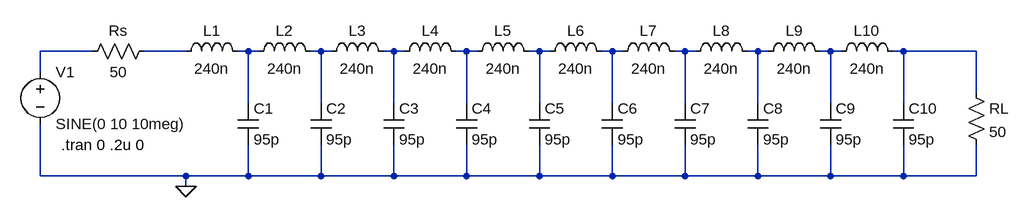
[diagram p0: schematic lab2_Schematic.asc]
lab2_Schematic.asc, the LTspice schematic file:
Version 4
SHEET 1 1592 680
WIRE 176 32 96 32
WIRE 320 32 256 32
WIRE 416 32 400 32
WIRE 432 32 416 32
WIRE 528 32 512 32
WIRE 544 32 528 32
WIRE 640 32 624 32
WIRE 656 32 640 32
WIRE 752 32 736 32
WIRE 768 32 752 32
WIRE 864 32 848 32
WIRE 880 32 864 32
WIRE 976 32 960 32
WIRE 992 32 976 32
WIRE 1088 32 1072 32
WIRE 1104 32 1088 32
WIRE 1200 32 1184 32
WIRE 1216 32 1200 32
WIRE 1312 32 1296 32
WIRE 1328 32 1312 32
WIRE 1424 32 1408 32
WIRE 1536 32 1424 32
WIRE 96 64 96 32
WIRE 1536 96 1536 32
WIRE 416 112 416 32
WIRE 528 112 528 32
WIRE 640 112 640 32
WIRE 752 112 752 32
WIRE 864 112 864 32
WIRE 976 112 976 32
WIRE 1088 112 1088 32
WIRE 1200 112 1200 32
WIRE 1312 112 1312 32
WIRE 1424 112 1424 32
WIRE 96 224 96 144
WIRE 320 224 96 224
WIRE 416 224 416 176
WIRE 416 224 320 224
WIRE 528 224 528 176
WIRE 528 224 416 224
WIRE 640 224 640 176
WIRE 640 224 528 224
WIRE 752 224 752 176
WIRE 752 224 640 224
WIRE 864 224 864 176
WIRE 864 224 752 224
WIRE 976 224 976 176
WIRE 976 224 864 224
WIRE 1088 224 1088 176
WIRE 1088 224 976 224
WIRE 1200 224 1200 176
WIRE 1200 224 1088 224
WIRE 1312 224 1312 176
WIRE 1312 224 1200 224
WIRE 1424 224 1424 176
WIRE 1424 224 1312 224
WIRE 1536 224 1536 176
WIRE 1536 224 1424 224
WIRE 320 240 320 224
FLAG 320 240 0
SYMBOL voltage 96 48 R0
WINDOW 123 0 0 Left 2
WINDOW 39 0 0 Left 2
SYMATTR InstName V1
SYMATTR Value SINE(0 10 10meg)
SYMBOL res 160 48 R270
WINDOW 0 32 56 VTop 2
WINDOW 3 0 56 VBottom 2
SYMATTR InstName Rs
SYMATTR Value 50
SYMBOL ind 304 48 R270
WINDOW 0 32 56 VTop 2
WINDOW 3 5 56 VBottom 2
SYMATTR InstName L1
SYMATTR Value 240n
SYMBOL ind 416 48 R270
WINDOW 0 32 56 VTop 2
WINDOW 3 5 56 VBottom 2
SYMATTR InstName L2
SYMATTR Value 240n
SYMBOL ind 528 48 R270
WINDOW 0 32 56 VTop 2
WINDOW 3 5 56 VBottom 2
SYMATTR InstName L3
SYMATTR Value 240n
SYMBOL ind 640 48 R270
WINDOW 0 32 56 VTop 2
WINDOW 3 5 56 VBottom 2
SYMATTR InstName L4
SYMATTR Value 240n
SYMBOL ind 752 48 R270
WINDOW 0 32 56 VTop 2
WINDOW 3 5 56 VBottom 2
SYMATTR InstName L5
SYMATTR Value 240n
SYMBOL ind 864 48 R270
WINDOW 0 32 56 VTop 2
WINDOW 3 5 56 VBottom 2
SYMATTR InstName L6
SYMATTR Value 240n
SYMBOL ind 976 48 R270
WINDOW 0 32 56 VTop 2
WINDOW 3 5 56 VBottom 2
SYMATTR InstName L7
SYMATTR Value 240n
SYMBOL ind 1088 48 R270
WINDOW 0 32 56 VTop 2
WINDOW 3 5 56 VBottom 2
SYMATTR InstName L8
SYMATTR Value 240n
SYMBOL ind 1200 48 R270
WINDOW 0 32 56 VTop 2
WINDOW 3 5 56 VBottom 2
SYMATTR InstName L9
SYMATTR Value 240n
SYMBOL ind 1312 48 R270
WINDOW 0 32 56 VTop 2
WINDOW 3 5 56 VBottom 2
SYMATTR InstName L10
SYMATTR Value 240n
SYMBOL cap 400 112 R0
SYMATTR InstName C1
SYMATTR Value 95p
SYMBOL cap 512 112 R0
SYMATTR InstName C2
SYMATTR Value 95p
SYMBOL cap 624 112 R0
SYMATTR InstName C3
SYMATTR Value 95p
SYMBOL cap 736 112 R0
SYMATTR InstName C4
SYMATTR Value 95p
SYMBOL cap 848 112 R0
SYMATTR InstName C5
SYMATTR Value 95p
SYMBOL cap 960 112 R0
SYMATTR InstName C6
SYMATTR Value 95p
SYMBOL cap 1072 112 R0
SYMATTR InstName C7
SYMATTR Value 95p
SYMBOL cap 1184 112 R0
SYMATTR InstName C8
SYMATTR Value 95p
SYMBOL cap 1296 112 R0
SYMATTR InstName C9
SYMATTR Value 95p
SYMBOL cap 1408 112 R0
SYMATTR InstName C10
SYMATTR Value 95p
SYMBOL res 1520 80 R0
SYMATTR InstName RL
SYMATTR Value 50
TEXT 128 176 Left 2 !.tran 0 .2u 0

The netlist it stands for:
* lab2_Schematic.asc
V1 N001 0 SINE(0 10 10meg)
Rs N001 N002 50
L1 N002 N003 240n
L2 N003 N004 240n
L3 N004 N005 240n
L4 N005 N006 240n
L5 N006 N007 240n
L6 N007 N008 240n
L7 N008 N009 240n
L8 N009 N010 240n
L9 N010 N011 240n
L10 N011 N012 240n
C1 N003 0 95p
C2 N004 0 95p
C3 N005 0 95p
C4 N006 0 95p
C5 N007 0 95p
C6 N008 0 95p
C7 N009 0 95p
C8 N010 0 95p
C9 N011 0 95p
C10 N012 0 95p
RL N012 0 50
.tran 0 .2u 0
.backanno
.end